# EAGLE design Round Rev2 (EAGLE 9.0.1)
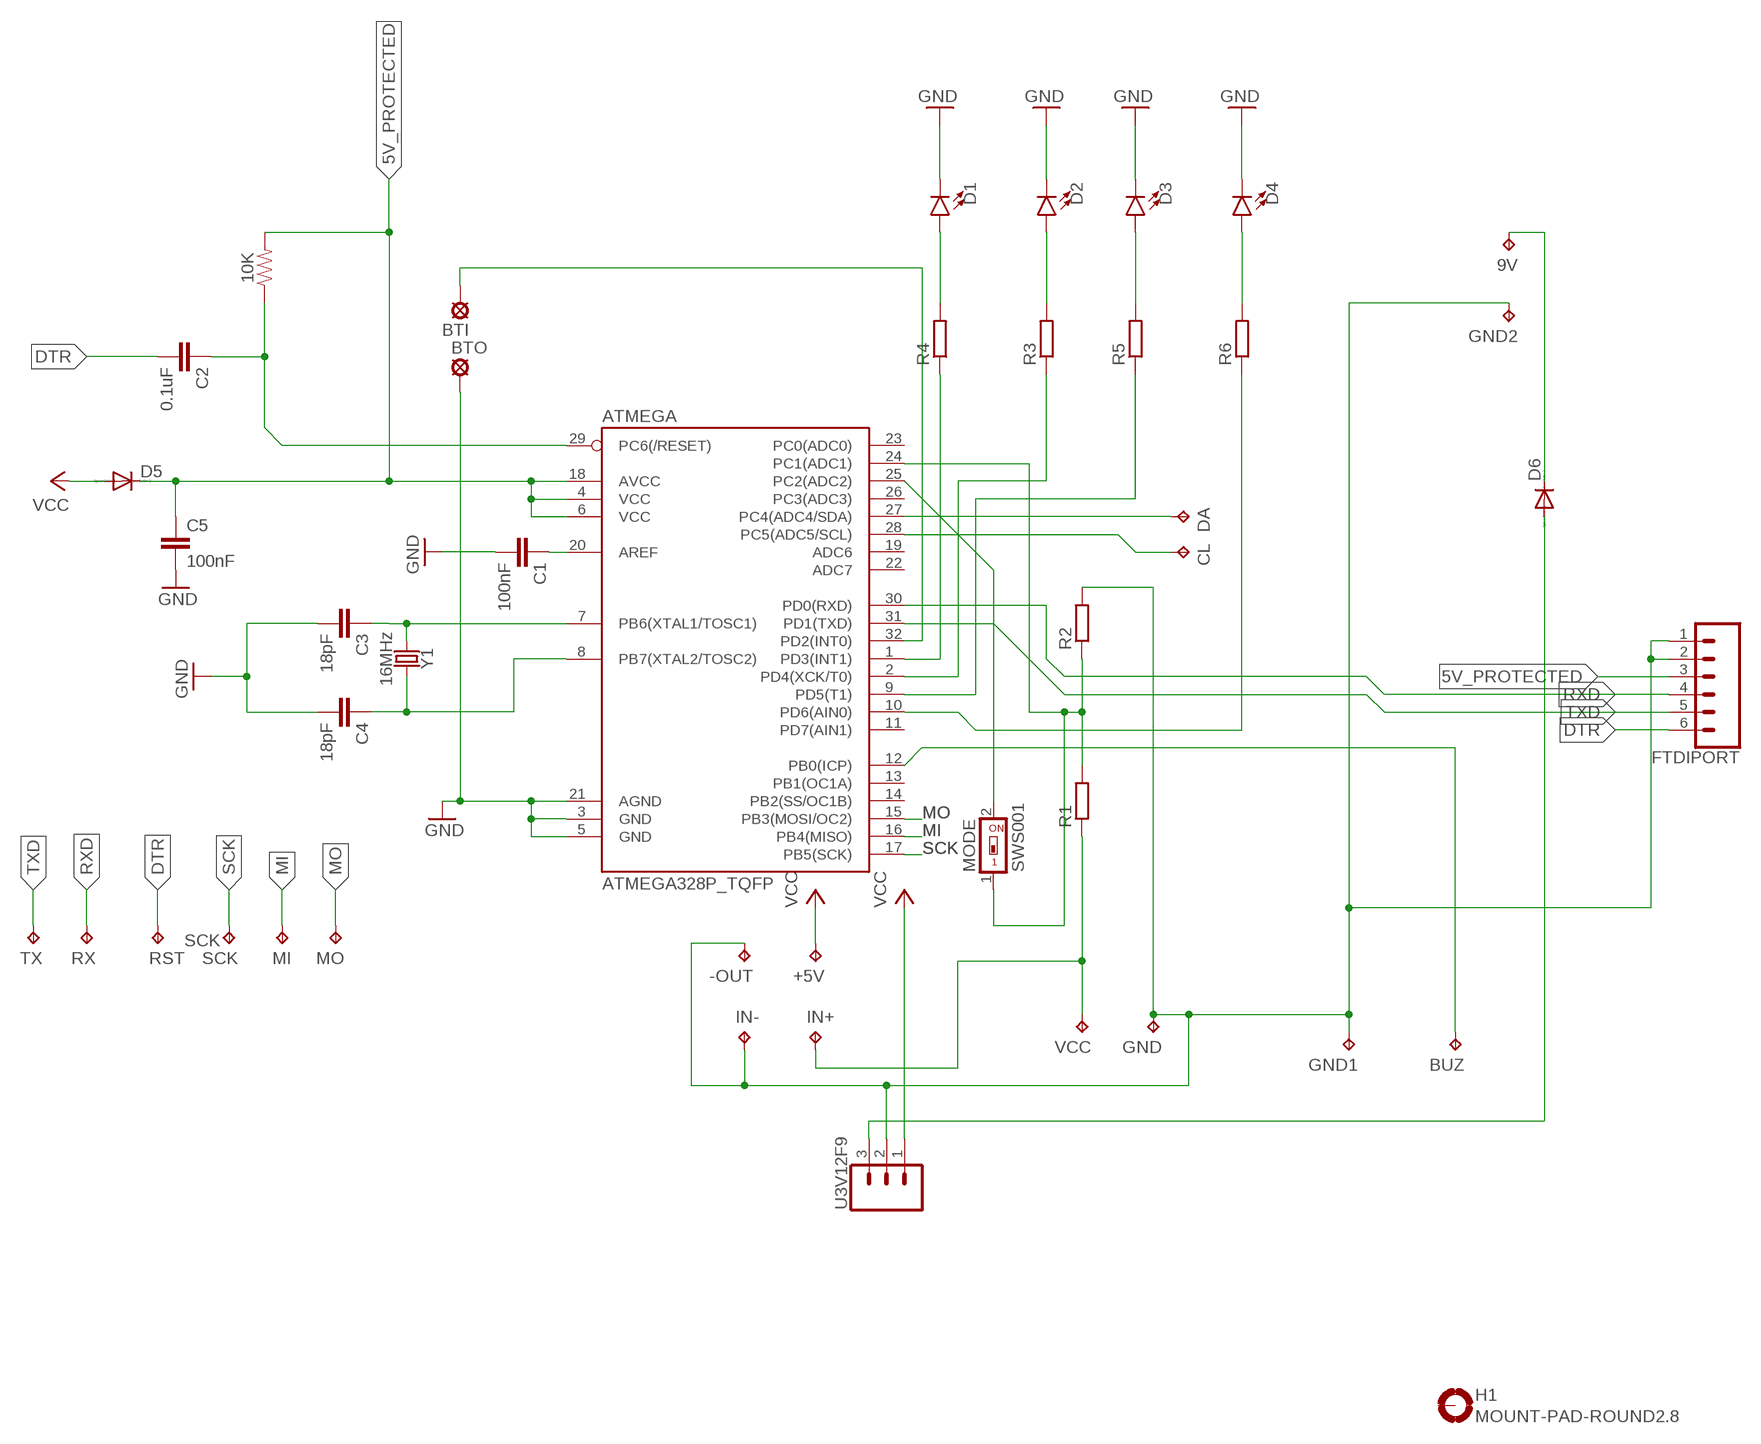
[diagram p0: schematic, sheet 1]

## Parts
9V  TPB2,54  [B2,54]
10K  0.27OHM-0603-1/10W-1%  [0603]
+5V  TPTP20SQ  [TP20SQ]
-OUT  TPTP20SQ  [TP20SQ]
ATMEGA  ATMEGA328P_TQFP  [TQFP32-08]
BTI  LSP10  [LSP10]
BTO  LSP10  [LSP10]
BUZ  TPB2,54  [B2,54]
C1  100nF  10NF-0603-50V-10%  [0603]
C2  0.1uF  10NF-0603-50V-10%  [0603]
C3  18pF  10NF-0603-50V-10%  [0603]
C4  18pF  10NF-0603-50V-10%  [0603]
C5  100nF  10NF-0603-50V-10%  [0603]
CL  TPB1,27  [B1,27]
D1  LED1206  [LED-1206]
D2  LED1206  [LED-1206]
D3  LED1206  [LED-1206]
D4  LED1206  [LED-1206]
D5  DIODE-SOD106A-R  [SOD106A-R]
D6  DIODE-SOD106A-R  [SOD106A-R]
DA  TPB1,27  [B1,27]
FTDIPORT  CONN_06SMD-1MM  [1X06-1MM]
GND  TPB2,54  [B2,54]
GND1  TPB2,54  [B2,54]
GND2  TPB2,54  [B2,54]
H1  MOUNT-PAD-ROUND2.8  [2,8-PAD]
IN+  TPTP20SQ  [TP20SQ]
IN-  TPTP20SQ  [TP20SQ]
MI  TPB1,27  [B1,27]
MO  TPB1,27  [B1,27]
MODE  SWS001  [SMS-001]
R1  R-EU_R1206  [R1206]
R2  R-EU_R1206  [R1206]
R3  R-EU_R1206  [R1206]
R4  R-EU_R1206  [R1206]
R5  R-EU_R1206  [R1206]
R6  R-EU_R1206  [R1206]
RST  TPB1,27  [B1,27]
RX  TPB1,27  [B1,27]
SCK  TPB1,27  [B1,27]
TX  TPB1,27  [B1,27]
U3V12F9  CONN_03  [1X03]
VCC  TPB2,54  [B2,54]
Y1  16MHz  CRYSTALSMD-5X3.2-2PAD  [CRYSTAL-SMD-5X3.2-2PAD]

## Nets
5V_PROTECTED: 10K.2 ATMEGA.4(VCC) ATMEGA.6(VCC) ATMEGA.18(AVCC) C5.1 D5.C FTDIPORT.3
9VOUT [power]: D6.A U3V12F9.3
AREF: ATMEGA.20(AREF) C1.1
BUTTON: ATMEGA.32(PD2(INT0)) BTI.MP
BUZZER: ATMEGA.12(PB0(ICP)) BUZ.TP
DTR: C2.2 FTDIPORT.6 RST.TP
GND: -OUT.TP ATMEGA.3(GND) ATMEGA.5(GND) ATMEGA.21(AGND) BTO.MP C1.2 C3.2 C4.2 C5.2 D1.C D2.C D3.C D4.C FTDIPORT.1 FTDIPORT.2 GND1.TP GND2.TP GND.TP IN-.TP R2.2 U3V12F9.2
GREEN1: D2.A R3.2
GREEN2: D3.A R5.2
GREEN3: D4.A R6.2
LED1: ATMEGA.1(PD3(INT1)) R4.1
LED2: ATMEGA.2(PD4(XCK/T0)) R3.1
LED3: ATMEGA.9(PD5(T1)) R5.1
LED4: ATMEGA.10(PD6(AIN0)) R6.1
MI: ATMEGA.16(PB4(MISO)) MI.TP
MO: ATMEGA.15(PB3(MOSI/OC2)) MO.TP
MODE: ATMEGA.25(PC2(ADC2)) MODE.2
MODESENS: ATMEGA.24(PC1(ADC1)) MODE.1 R1.2 R2.1
N$21 [power]: 9V.TP D6.C
RED: D1.A R4.2
RESET: 10K.1 ATMEGA.29(PC6(/RESET)) C2.1
RXD: ATMEGA.30(PD0(RXD)) FTDIPORT.4 RX.TP
SCK: ATMEGA.17(PB5(SCK)) SCK.TP
SCL: ATMEGA.28(PC5(ADC5/SCL)) CL.TP
SDA: ATMEGA.27(PC4(ADC4/SDA)) DA.TP
TXD: ATMEGA.31(PD1(TXD)) FTDIPORT.5 TX.TP
VCC [power]: +5V.TP D5.A IN+.TP R1.1 U3V12F9.1 VCC.TP
XTAL1: ATMEGA.7(PB6(XTAL1/TOSC1)) C3.1 Y1.P$1
XTAL2: ATMEGA.8(PB7(XTAL2/TOSC2)) C4.1 Y1.P$2
Unconnected: ATMEGA.11(PD7(AIN1)) ATMEGA.13(PB1(OC1A)) ATMEGA.14(PB2(SS/OC1B)) ATMEGA.19(ADC6) ATMEGA.22(ADC7) ATMEGA.23(PC0(ADC0)) ATMEGA.26(PC3(ADC3)) H1.B2,8(MOUNT)

## Library data of the parts
9V +5V -OUT BUZ CL DA GND GND1 GND2 IN+ IN- MI MO RST RX TX VCC = testpad:TP: Test pad
10K = SparkFun-Resistors:0.27OHM: 0.27Ω resistor A resistor is a passive two-terminal electrical component that implements electrical resistance as a circuit element. Resistors act to reduce current flow, and, at the same time, act to lower voltage levels within circuits. - Wikipedia; PROD_ID: RES-08787; VALUE: 0.27
ATMEGA = SparkFun-IC-Microcontroller:ATMEGA328P_TQFP: Popular 328P in QFP Storefront component: ATmega328 - TQFP <https://www.sparkfun.com/products/13448> (COM-13448) Datasheet <http://www.sparkfun.com/datasheets/Components/SMD/ATMega328.pdf> SparkFun Products SparkFun RedBoard - Programmed with Arduino <https://www.sparkfun.com/products/12757> (DEV-12757) Arduino Pro Mini 328 - 5V/16MHz <https://www.sparkfun.com/products/11113> (DEV-11113) Arduino Pro Mini 328 - 3.3V/8MHz <https://www.sparkfun.com/products/11114> (DEV-11114) SparkFun OpenLog <https://www.sparkfun.com/products/13712> (DEV-13712) SparkFun MicroView - OLED Arduino Module <https://www.sparkfun.com/products/12923> (DEV-12923) SparkFun Digital Sandbox <https://www.sparkfun.com/products/12651> (DEV-12651) SparkFun PicoBoard <https://www.sparkfun.com/products/11888> (WIG-11888) Arduino Fio <https://www.sparkfun.com/products/10116> (DEV-10116) LilyPad Arduino 328 Main Board <https://www.sparkfun.com/products/13342> (DEV-13342) SparkFun RedStick <https://www.sparkfun.com/products/13741> (DEV-13741) LilyPad MP3 <https://www.sparkfun.com/products/11013> (DEV-11013) LilyPad Arduino SimpleSnap <https://www.sparkfun.com/products/10941> (DEV-10941) SparkFun Stepoko <https://www.sparkfun.com/products/13899> (ROB-13899) SparkFun Geiger Counter <https://www.sparkfun.com/products/11345> (SEN-11345) SparkFun EL Sequencer <https://www.sparkfun.com/products/12781> (COM-12781) Arduino Pro 328 - 5V/16MHz <https://www.sparkfun.com/products/10915> (DEV-10915) CryptoCape <https://www.sparkfun.com/products/12773> (DEV-12773) SparkFun IR Thermometer Evaluation Board - MLX90614 <https://www.sparkfun.com/products/10740> (SEN-10740) SparkFun RedBot Mainboard <https://www.sparkfun.com/products/12097> (ROB-12097) Arduino Pro 328 - 3.3V/8MHz <https://www.sparkfun.com/products/10914> (DEV-10914) SparkFun Block for Intel® Edison - Arduino <https://www.sparkfun.com/products/13036> (DEV-13036) SparkFun Simon Says - Surface Mount Soldering Kit <https://www.sparkfun.com/products/10935> (KIT-10935) SparkFun 7-Segment Serial Display - Red <https://www.sparkfun.com/products/11441> (COM-11441) SparkFun 7-Segment Serial Display - White <https://www.sparkfun.com/products/11629> (COM-11629) SparkFun 7-Segment Serial Display - Yellow <https://www.sparkfun.com/products/11443> (COM-11443) SparkFun 7-Segment Serial Display - Kelly Green <https://www.sparkfun.com/products/11440> (COM-11440) SparkFun 7-Segment Serial Display - Blue <https://www.sparkfun.com/products/11442> (COM-11442) SparkFun OpenSegment Serial Display - 20mm (Blue) <https://www.sparkfun.com/products/11647> (COM-11647) SparkFun OpenSegment Serial Display - 20mm (Green) <https://www.sparkfun.com/products/11646> (COM-11646) SparkFun OpenSegment Serial Display - 20mm (White) <https://www.sparkfun.com/products/11648> (COM-11648) SparkFun OpenSegment Serial Display - 20mm (Red) <https://www.sparkfun.com/products/11644> (COM-11644) SparkFun OpenSegment Serial Display - 20mm (Yellow) <https://www.sparkfun.com/products/11645> (COM-11645) SparkFun OpenSegment Shield <https://www.sparkfun.com/products/13190> (DEV-13190); PROD_ID: IC-09069
BTI BTO = solpad:LSP10: SOLDER PAD drill 1.0 mm, distributor Buerklin, 12H555
C1-C5 = SparkFun-Capacitors:10NF: 0.01uF/10nF/10,000pF ceramic capacitors A capacitor is a passive two-terminal electrical component used to store electrical energy temporarily in an electric field. CAP-09321; PROD_ID: CAP-00867; VALUE: 10nF
D1-D4 = SparkFun-LED:LED: LED (Generic) Standard schematic elements and footprints for 5mm, 3mm, 1206, and 0603 sized LEDs. Generic LEDs with no color specified.
D5 D6 = diode:DIODE-: DIODE
FTDIPORT = SparkFun-Connectors:CONN_06: Multi connection point. Often used as Generic Header-pin footprint for 0.1 inch spaced/style header connections On any of the 0.1 inch spaced packages, you can populate with these: Break Away Headers - Straight <https://www.sparkfun.com/products/116> (PRT-00116) Break Away Male Headers - Right Angle <https://www.sparkfun.com/products/553> (PRT-00553) Female Headers <https://www.sparkfun.com/products/115> (PRT-00115) Break Away Headers - Machine Pin <https://www.sparkfun.com/products/117> (PRT-00117) Break Away Female Headers - Swiss Machine Pin <https://www.sparkfun.com/products/743> (PRT-00743) Arduino Stackable Header - 6 Pin <https://www.sparkfun.com/products/9280> (PRT-09280) For SCREWTERMINALS and SPRING TERMINALS visit here: Screw Terimnals on SparkFun.com <https://www.sparkfun.com/search/results?term=Screw+Terminals> (5mm/3.5mm/2.54mm spacing) This device is also useful as a general connection point to wire up your design to another part of your project. Our various solder wires solder well into these plated through hole pads. Hook-Up Wire - Assortment (Stranded, 22 AWG) <https://www.sparkfun.com/products/11375> (PRT-11375) Hook-Up Wire - Assortment (Solid Core, 22 AWG) <https://www.sparkfun.com/products/11367> (PRT-11367) View the entire wire category on our website here <https://www.sparkfun.com/categories/141>; PROD_ID: CONN-08249; SF_ID: GPS-00579
H1 = holes:MOUNT-PAD-ROUND: MOUNTING PAD, round
MODE = smd-special:SWS001: SMD Dip Switch 1 pol.
R1-R6 = Clean-Kong:R-EU_: RESISTOR, European symbol
SCK = testpad:TP: Test pad; TP_SIGNAL_NAME: SCK
U3V12F9 = SparkFun-Connectors:CONN_03: Multi connection point. Often used as Generic Header-pin footprint for 0.1 inch spaced/style header connections On any of the 0.1 inch spaced packages, you can populate with these: Break Away Headers - Straight <https://www.sparkfun.com/products/116> (PRT-00116) Break Away Male Headers - Right Angle <https://www.sparkfun.com/products/553> (PRT-00553) Female Headers <https://www.sparkfun.com/products/115> (PRT-00115) Break Away Headers - Machine Pin <https://www.sparkfun.com/products/117> (PRT-00117) Break Away Female Headers - Swiss Machine Pin <https://www.sparkfun.com/products/743> (PRT-00743) Stackable Header - 3 Pin (Female, 0.1") <https://www.sparkfun.com/products/13875> (PRT-13875) For SCREWTERMINALS and SPRING TERMINALS visit here: Screw Terimnals on SparkFun.com <https://www.sparkfun.com/search/results?term=Screw+Terminals> (5mm/3.5mm/2.54mm spacing) This device is also useful as a general connection point to wire up your design to another part of your project. Our various solder wires solder well into these plated through hole pads. Hook-Up Wire - Assortment (Stranded, 22 AWG) <https://www.sparkfun.com/products/11375> (PRT-11375) Hook-Up Wire - Assortment (Solid Core, 22 AWG) <https://www.sparkfun.com/products/11367> (PRT-11367) View the entire wire category on our website here <https://www.sparkfun.com/categories/141> Special notes: Molex polarized connector foot print use with SKU : PRT-08232 with associated crimp pins and housings.
Y1 = SparkFun-Clocks:CRYSTAL: Crystals (Generic) These are passive quartz crystals, which can be used as a clock source for a microcontroller. Crystal's are two-terminal devices. They require external "load" capacitors to generate an oscillating signal.

## Net classes
0 default: width 0.2 mm, drill 0.254 mm, clearance 0.16 mm
1 power: width 0.4 mm, drill 0.254 mm, clearance 0.4 mm

## Board
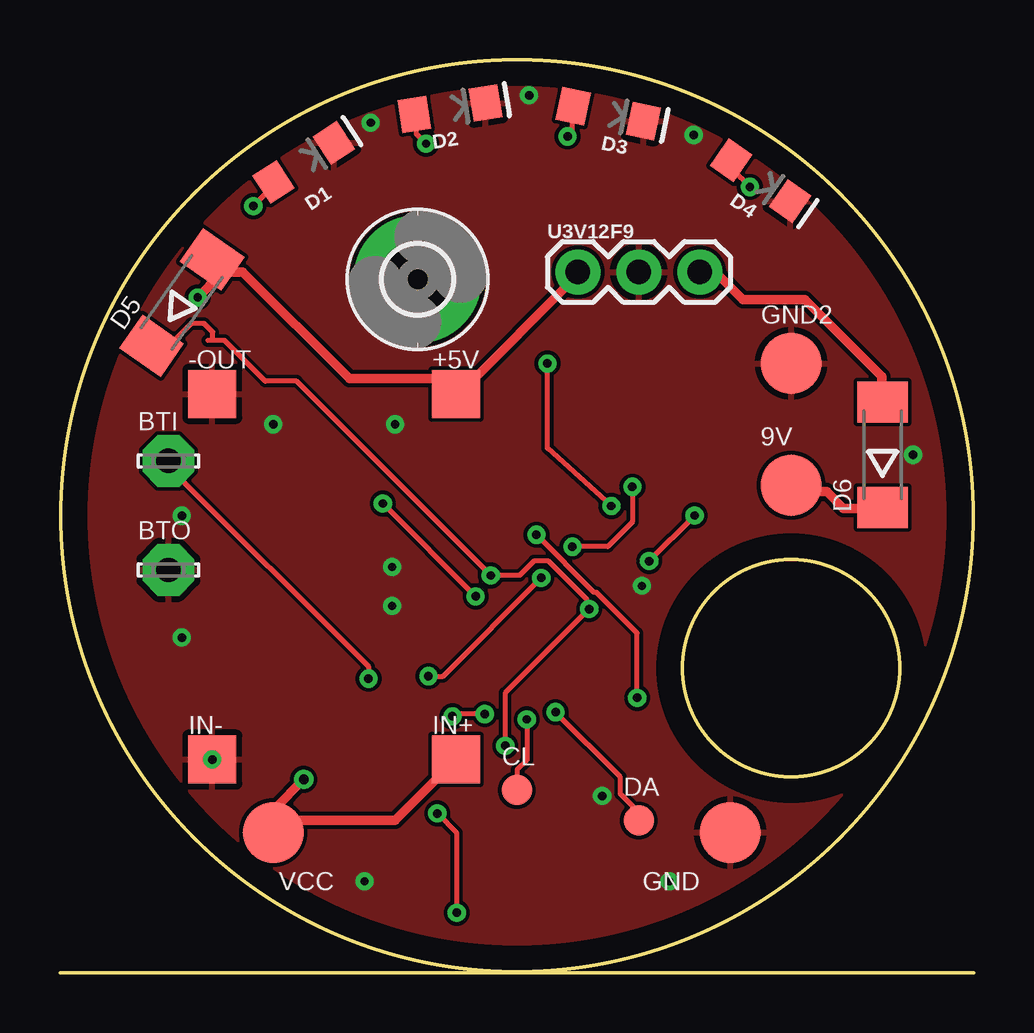
[diagram p1: board, top side]
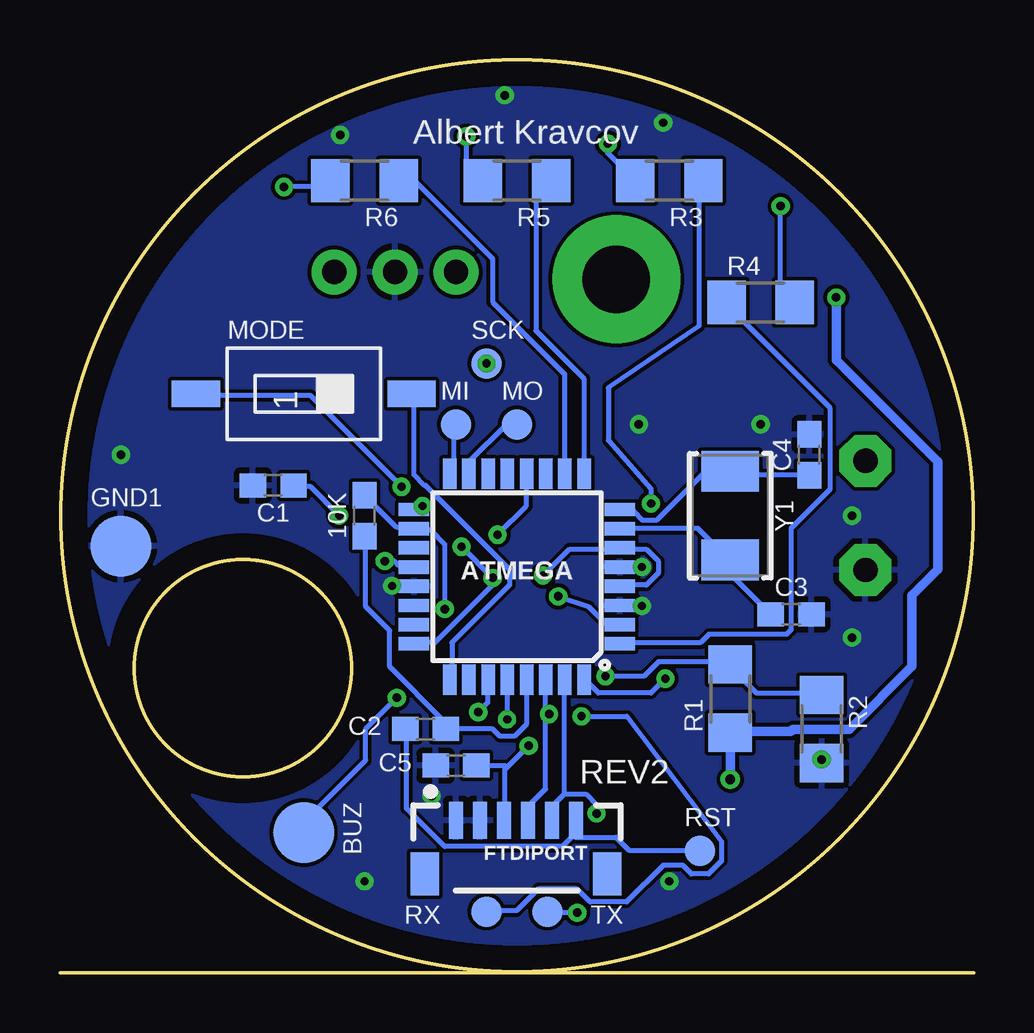
[diagram p2: board, bottom side, seen from below]

Size 38.1 x 38.05 mm. Coordinates in mm from the lower left corner, seen from the top.
Outline: circle at 19.05,19.05 radius 19
Outline: circle at 30.48,12.7 radius 4.52
Copper layers (1*16): Top 0.035mm / dielectric 1.5mm / Bottom 0.035mm
Design rules "default *": minimum track width 6mil, minimum drill 0.35mm, track to track 6mil, track to pad 6mil, pad to pad 6mil, via to via 6mil, smd to smd 6mil, copper to edge 40mil, drill to drill 6mil, minimum pad ring 10mil, minimum via ring 8mil, stop-mask expansion 4mil, vias tented up to drill 2mm, thermal gap 10mil

### Footprints (pad centres in the part's own frame; a part is rotated, then mirrored left to right if it is on the bottom)
B2,54 = smd 2.54 x 2.54: TP 0,0
0603 = smd 1.1 x 1: 1 -0.85,0; 2 0.85,0
TP20SQ = smd 2 x 2: TP 0,0
TQFP32-08 = smd 1.27 x 0.559: 1 -4.293,2.8; 2 -4.293,2; 3 -4.293,1.2; 4 -4.293,0.4; 5 -4.293,-0.4; 6 -4.293,-1.2; 7 -4.293,-2; 8 -4.293,-2.8; 17 4.293,-2.8; 18 4.293,-2; 19 4.293,-1.2; 20 4.293,-0.4; 21 4.293,0.4; 22 4.293,1.2; 23 4.293,2; 24 4.293,2.8 | smd 0.559 x 1.27: 9 -2.8,-4.293; 10 -2,-4.293; 11 -1.2,-4.293; 12 -0.4,-4.293; 13 0.4,-4.293; 14 1.2,-4.293; 15 2,-4.293; 16 2.8,-4.293; 25 2.8,4.293; 26 2,4.293; 27 1.2,4.293; 28 0.4,4.293; 29 -0.4,4.293; 30 -1.2,4.293; 31 -2,4.293; 32 -2.8,4.293
LSP10 = drill 1.016 pad 2.159 octagon: MP 0,0
B1,27 = smd 1.27 x 1.27: TP 0,0
LED-1206 = smd 1.2 x 1.4: A -1.5,0; C 1.5,0
SOD106A-R = smd 1.7 x 2.1: A 2.2,0; C -2.2,0
1X06-1MM = smd 0.6 x 1.55: 1 -2.54,1.27; 2 -1.54,1.27; 3 -0.54,1.27; 4 0.46,1.27; 5 1.46,1.27; 6 2.46,1.27 | smd 1.2 x 1.8: P$1 -3.84,-0.955; P$2 3.76,-0.955
2,8-PAD = drill 2.8 pad 5.334: B2,8 0,0
SMS-001 = smd 1.092 x 2.007: 1 0,-4.496; 2 0,4.496
R1206 = smd 1.6 x 1.803: 1 -1.422,0; 2 1.422,0
1X03 = drill 1.016 pad 1.88: 1 0,0; 2 2.54,0; 3 5.08,0
CRYSTAL-SMD-5X3.2-2PAD = smd 1.7 x 2.4: P$1 1.85,0; P$2 -1.85,0

### Placement (x,y rotation side)
9V  30.48,20.32 0 top
10K  25.4,19.05 90 bottom
+5V  16.51,24.13 0 top
-OUT  6.35,24.13 0 top
ATMEGA  19.05,16.51 180 bottom
BTI  4.52,21.34 0 top
BTO  4.52,16.79 0 top
BUZ  27.94,5.84 270 bottom
C1  29.21,20.32 180 bottom
C2  22.86,10.16 180 bottom
C3  7.62,14.94 0 bottom
C4  6.86,21.59 90 bottom
C5  21.59,8.64 180 bottom
CL  19.05,7.62 0 top
D1  10.16,33.78 33 top
D2  16.26,36.02 9 top
D3  22.86,35.81 348 top
D4  29.21,33.02 325 top
D5  5.08,27.94 55 top
D6  34.29,21.59 90 top
DA  24.13,6.35 0 top
FTDIPORT  19.05,5.08 0 bottom
GND  27.94,5.84 270 top
GND1  35.56,17.78 0 bottom
GND2  30.48,25.4 0 top
H1  14.91,28.91 0 top
IN+  16.51,8.89 0 top
IN-  6.35,8.89 0 top
MI  21.59,22.86 0 bottom
MO  19.05,22.86 0 bottom
MODE  27.94,24.13 270 bottom
R1  10.16,11.43 90 bottom
R2  6.35,10.16 270 bottom
R3  12.7,33.02 180 bottom
R4  8.89,27.94 0 bottom
R5  19.05,33.02 180 bottom
R6  25.4,33.02 180 bottom
RST  11.43,5.08 0 bottom
RX  20.32,2.54 0 bottom
SCK  20.32,25.4 0 bottom
TX  17.78,2.54 0 bottom
U3V12F9  21.59,29.21 0 top
VCC  8.89,5.84 270 top
Y1  10.16,19.05 270 bottom

### Tracks (layer width: path | path; a pad name or v marks a point on that pad's centre or on a via)
5V_PROTECTED  (via drill 0.35)
  Top 0.2: v18.56,9.46 18.56,11.66 v22.06,15.16 21.96,15.16 21.96,15.56 20.36,17.16 19.76,17.16 19.16,16.56 v17.96,16.56 9.86,24.66 8.56,24.66 6.86,26.36 6.37,26.36 | 6.37,26.36 6.16,26.36 | 6.37,26.36 6.37,26.71 6.01,27.07 5.47,27.07 4.57,26.17 3.85,26.17 D5.C
  Bottom 0.2: v18.56,9.46 19.46,8.57 | 19.46,8.57 19.56,8.46 19.56,6.36 FTDIPORT.3 | v22.06,15.16 22.06,17.86 22.66,18.46 23.26,18.46 23.29,18.52 ATMEGA.18 23.36,18.56 24.06,18.56 10K.2 | 14.83,17.66 16.86,17.66 v17.96,16.56 | 14.83,17.66 14.76,17.66 | ATMEGA.4 14.66,16.16 13.66,16.16 13.16,16.66 13.16,17.16 13.66,17.66 14.66,17.66 ATMEGA.6 14.83,17.71 14.83,17.66 | C5.1 20.68,8.62 19.51,8.62 19.46,8.57
9VOUT
  Top 0.4: D6.A 34.26,23.86 34.26,24.86 31.06,28.06 28.46,28.06 27.36,29.16 26.76,29.16 U3V12F9.3
AREF  (via drill 0.35)
  Top 0.2: v24.56,17.16 v26.46,19.06
  Bottom 0.2: v26.46,19.06 27.66,20.26 28.36,20.26 C1.1 | v24.56,17.16 24.16,17.16 23.96,16.96 23.36,16.96 ATMEGA.20
BUTTON  (via drill 0.35)
  Top 0.2: v12.86,12.26 12.86,12.76 4.56,21.06 4.56,21.26 BTI.MP
  Bottom 0.2: v12.86,12.26 13.46,11.66 15.66,11.66 16.16,12.16 ATMEGA.32
BUZZER  (via drill 0.35)
  Top 0.2: v19.86,18.26 22.26,15.86 22.36,15.86 24.06,14.16 v24.06,11.46
  Bottom 0.2: v19.86,18.26 18.66,19.46 18.66,20.76 ATMEGA.12 | v24.06,11.46 25.36,10.16 25.36,8.86 27.86,6.36 BUZ.TP
DTR
  Bottom 0.2: 23.66,10.15 23.66,6.86 22.06,5.26 17.16,5.26 16.66,5.76 16.66,6.26 FTDIPORT.6 16.63,5.65 14.92,5.65 14.38,5.11 11.51,5.11 RST.TP | 23.66,10.15 23.66,10.16 | C2.2 23.74,10.15 23.66,10.15
GND  (via drill 0.33, 0.35)
  other vias: 12.95,35.43 19.56,36.58 12.7,3.81 26.42,34.93 25.4,3.81 35.56,21.59 13.84,15.29 13.84,16.92 24.26,16.13 22.61,7.37 6.35,8.89 5.08,19.05 5.08,13.97 8.89,22.86 13.97,22.86
  pour Top: -5.08,41.91 40.64,41.91 40.64,-3.81 -5.08,-3.81
  pour Bottom: -3.81,40.64 41.91,40.64 41.91,-2.54 -3.81,-2.54
GREEN1  (via drill 0.35)
  Top 0.2: v15.26,34.56 14.86,34.96 14.86,35.76 D2.A
  Bottom 0.2: v15.26,34.56 15.26,34.16 14.16,33.06 R3.2
GREEN2  (via drill 0.35)
  Top 0.2: v21.16,34.86 21.36,35.06 21.36,36.06 D3.A
  Bottom 0.2: v21.16,34.86 21.16,33.66 20.56,33.06 R5.2
GREEN3  (via drill 0.35)
  Top 0.2: v28.76,32.76 28.06,33.46 28.06,33.86 D4.A
  Bottom 0.2: v28.76,32.76 27.06,32.76 26.86,32.96 R6.2
LED1
  Bottom 0.2: 14.66,13.76 ATMEGA.1 14.56,13.75 11.41,13.75 11.05,14.11 7.81,14.11 7.63,14.29 7.63,18.52 6.01,20.14 6.01,23.56 10.24,27.79 R4.1 10.26,27.86
LED2  (via drill 0.35)
  Top 0.2: v13.46,19.56 v17.33,15.69
  Bottom 0.2: v17.33,15.69 16.06,15.26 15.36,14.56 14.76,14.56 ATMEGA.2 | v13.46,19.56 13.46,20.16 15.24,22.19 15.24,24.39 11.46,26.96 11.46,32.86 11.36,32.96 R3.1
LED3
  Bottom 0.2: ATMEGA.9 16.26,20.86 16.26,24.76 18.26,26.76 18.26,32.36 17.66,32.96 R5.1
LED4
  Bottom 0.2: ATMEGA.10 17.06,20.86 17.06,24.96 20.06,27.96 20.06,29.76 23.26,32.96 23.96,32.96 R6.1
MI
  Bottom 0.2: MI.TP 21.67,22.84 21.67,21.04 21.85,20.86 ATMEGA.16
MO
  Bottom 0.2: ATMEGA.15 21.04,20.86 21.04,21.31 19.51,22.84 19.06,22.84 MO.TP
MODE
  Bottom 0.152: 19.36,16.82 19.36,16.76
  Bottom 0.2: 19.36,16.76 19.36,16.16 21.76,13.76 21.76,12.26 ATMEGA.25 | MODE.2 23.36,24.06 23.36,20.76 22.92,20.32 22.86,20.32 19.36,16.82
MODESENS  (via drill 0.35)
  Top 0.2: v20.06,16.46 15.96,12.36 v15.36,12.36 | v23.86,20.26 23.86,18.78 22.84,17.76 v21.36,17.76
  Bottom 0.2: v15.36,12.36 13.76,12.36 13.16,12.96 10.26,12.96 R1.2 10.16,12.76 9.06,11.66 6.36,11.66 R2.1 | ATMEGA.24 23.26,13.76 22.46,13.76 20.06,16.16 v20.06,16.46 v21.36,17.76 | v23.86,20.26 27.66,24.06 32.36,24.06 MODE.1
N$21
  Top 0.4: D6.C 34.26,19.36 32.66,19.36 31.96,20.06 31.66,20.06 31.46,20.26 30.56,20.26 9V.TP
RED  (via drill 0.35)
  Top 0.2: v8.06,31.96 8.86,32.76 8.86,32.96 D1.A
  Bottom 0.2: v8.06,31.96 8.06,28.46 7.56,27.96 R4.2
RESET
  Bottom 0.2: ATMEGA.29 18.66,12.16 18.66,10.36 19.16,9.86 19.76,9.86 20.06,10.16 C2.1 22.06,10.16 22.06,10.46 24.36,12.76 24.36,14.26 25.36,15.26 25.36,18.16 10K.1
RXD  (via drill 0.35)
  Top 0.2: v16.36,10.69 16.45,10.78 v17.71,10.78
  Bottom 0.2: 17.86,10.78 17.86,7.66 18.56,6.96 18.56,6.36 FTDIPORT.4 | 17.86,10.78 17.86,12.16 ATMEGA.30 | v16.36,10.69 14.47,10.69 10.52,5.47 10.52,4.66 11.06,4.12 11.78,4.12 12.14,4.48 12.95,4.48 14.48,2.95 16,2.95 16.54,3.49 18.16,3.49 19.06,2.59 20.32,2.59 RX.TP | 17.86,10.78 v17.71,10.78
SCK  (via drill 0.35)
  Top 0.2: v22.99,19.46 20.32,21.87 SCK.TP
  Bottom 0.152: ATMEGA.17 v22.99,19.46
  other vias: 20.32,25.4
SCL  (via drill 0.35)
  Top 0.2: v19.46,10.56 19.46,8.86 19.06,8.46 19.06,7.66 CL.TP
  Bottom 0.2: v19.46,10.56 19.46,12.16 ATMEGA.28
SDA  (via drill 0.35)
  Top 0.2: v20.66,10.86 23.36,8.16 23.36,7.46 24.06,6.76 24.06,6.36 DA.TP
  Bottom 0.2: v20.66,10.86 20.26,11.26 20.26,12.16 ATMEGA.27
TXD  (via drill 0.35)
  Top 0.2: v16.54,2.5 16.54,5.83 v15.73,6.64
  Bottom 0.2: 17.06,7.46 17.06,12.16 ATMEGA.31 | 17.06,7.46 17.56,6.96 17.56,6.36 FTDIPORT.5 | v16.54,2.5 17.71,2.5 TX.TP | v15.73,6.64 15.73,7 16.18,7.45 16.99,7.45 17.06,7.46
VCC  (via drill 0.35, 0.4)
  Top 0.4: v10.16,8.06 8.96,6.86 8.96,6.36 VCC.TP 8.89,6.35 13.97,6.35 IN+.TP | 16.46,23.36 +5V.TP | +5V.TP 15.88,24.77 12.07,24.77 7.62,29.21 6.35,29.21 6.28,29.32 6.28,29.68 D5.A 6.64,29.05 v5.74,28.15 | 16.57,24.07 21.66,29.16 U3V12F9.1 | 16.57,24.07 16.56,24.06 | +5V.TP 16.54,24.19 16.57,24.07
  Bottom 0.4: v10.16,8.06 R1.1 9.97,10.06 7.63,10.06 7.54,10.15 5.2,10.15 2.59,12.76 2.59,15.73 1.51,16.81 1.51,21.31 5.74,25.54 v5.74,28.15
XTAL1
  Bottom 0.2: 14.74,18.52 ATMEGA.7 14.65,18.52 11.5,18.52 10.24,17.26 Y1.P$1 10.16,16.62 C3.1
XTAL2
  Bottom 0.2: 14.83,19.33 ATMEGA.8 | 14.92,19.33 ATMEGA.8 | C4.1 10,20.74 Y1.P$2 10.24,20.86 11.23,20.86 13.21,18.88 13.84,18.88 14.2,19.24 14.74,19.24 ATMEGA.8

### Text on the board
bPlace: Albert Kravcov | REV2